# EAGLE design cpu_disc (EAGLE 4.16)
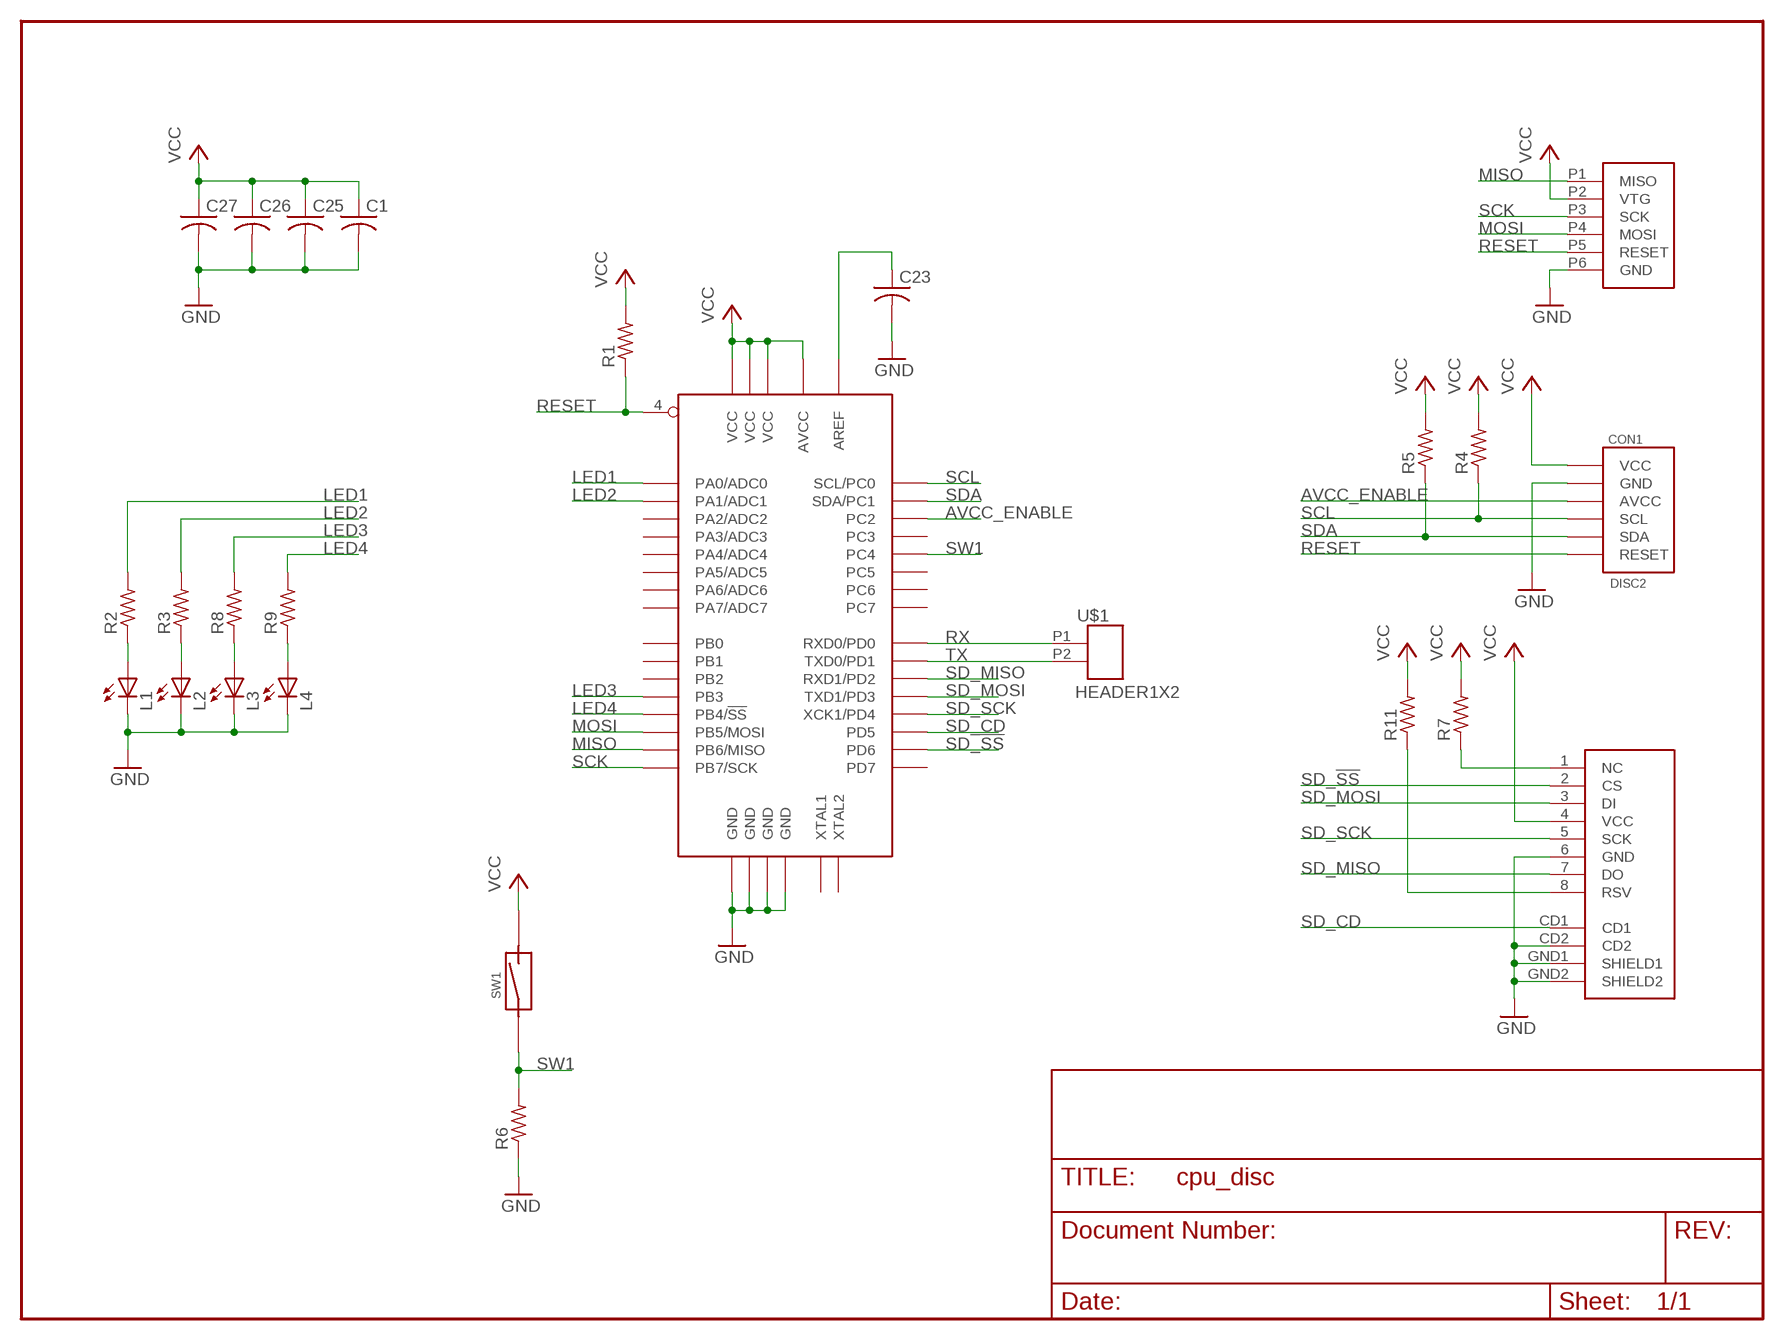
[diagram p0: schematic, sheet 1]

## Parts
C1  C-USC1206  [C1206]
C23  C-USC0603  [C0603]
C25  C-USC0805  [C0805]
C26  C-USC0805  [C0805]
C27  C-USC0805  [C0805]
CON1  DISC2  [DISC2]
IC1  ATMEGA644P  [TQFP44]
ISP1  AVR_ISP_6  [AVR_ISP_6]
L1  LEDCHIP-LED0603  [CHIP-LED0603]
L2  LEDCHIP-LED0603  [CHIP-LED0603]
L3  LEDCHIP-LED0603  [CHIP-LED0603]
L4  LEDCHIP-LED0603  [CHIP-LED0603]
R1  R-US_R0603  [R0603]
R2  R-US_R0603  [R0603]
R3  R-US_R0603  [R0603]
R4  R-US_R0603  [R0603]
R5  R-US_R0603  [R0603]
R6  R-US_R0603  [R0603]
R7  R-US_R0603  [R0603]
R8  R-US_R0603  [R0603]
R9  R-US_R0603  [R0603]
R11  R-US_R0603  [R0603]
SW1  FR2259  [FR2259]
U$1  HEADER1X2  [HEADER1X2]
U$5  USD-SOCKETUSD  [USD-SOCKET-PP]

## Nets
AREF: C23.1 IC1.29(AREF)
AVCC_ENABLE: CON1.AVCC IC1.21(PC2)
GND: C1.2 C23.2 C25.2 C26.2 C27.2 CON1.GND IC1.6(GND) IC1.18(GND) IC1.28(GND) IC1.39(GND) ISP1.P6(GND) L1.C L2.C L3.C L4.C R6.1 U$5.6(GND) U$5.CD2 U$5.GND1(SHIELD1) U$5.GND2(SHIELD2)
LED1: IC1.37(PA0/ADC0) R2.2
LED2: IC1.36(PA1/ADC1) R3.2
LED3: IC1.43(PB3) R8.2
LED4: IC1.44(PB4/!SS) R9.2
MISO: IC1.2(PB6/MISO) ISP1.P1(MISO)
MOSI: IC1.1(PB5/MOSI) ISP1.P4(MOSI)
N$1: L1.A R2.1
N$2: L2.A R3.1
N$4: R7.1 U$5.1(NC)
N$5: R11.1 U$5.8(RSV)
N$6: L3.A R8.1
N$7: L4.A R9.1
RESET: CON1.RESET IC1.4(RESET) ISP1.P5(RESET) R1.1
RX: IC1.9(RXD0/PD0) U$1.P1
SCK: IC1.3(PB7/SCK) ISP1.P3(SCK)
SCL: CON1.SCL IC1.19(SCL/PC0) R4.1
SD_!SS: IC1.15(PD6) U$5.2(CS)
SD_CD: IC1.14(PD5) U$5.CD1
SD_MISO: IC1.11(RXD1/PD2) U$5.7(DO)
SD_MOSI: IC1.12(TXD1/PD3) U$5.3(DI)
SD_SCK: IC1.13(XCK1/PD4) U$5.5(SCK)
SDA: CON1.SDA IC1.20(SDA/PC1) R5.1
SW1: IC1.23(PC4) R6.2 SW1.P$1
TX: IC1.10(TXD0/PD1) U$1.P2
VCC: C1.1 C25.1 C26.1 C27.1 CON1.VCC IC1.5(VCC) IC1.17(VCC) IC1.27(AVCC) IC1.38(VCC) ISP1.P2(VTG) R1.2 R4.2 R5.2 R7.2 R11.2 SW1.P$2 U$5.4(VCC)
Unconnected: IC1.7(XTAL2) IC1.8(XTAL1) IC1.16(PD7) IC1.22(PC3) IC1.24(PC5) IC1.25(PC6) IC1.26(PC7) IC1.30(PA7/ADC7) IC1.31(PA6/ADC6) IC1.32(PA5/ADC5) IC1.33(PA4/ADC4) IC1.34(PA3/ADC3) IC1.35(PA2/ADC2) IC1.40(PB0) IC1.41(PB1) IC1.42(PB2)

## Library data of the parts
C1 C23 C25-C27 = rcl:C-US: CAPACITOR, American symbol
CON1 = anton:DISC2
IC1 = anton:ATMEGA644P
ISP1 = anton:AVR_ISP_6
L1-L4 = led:LED: LED OSRAM: - CHIPLED LG R971, LG N971, LY N971, LG Q971, LY Q971, LO R971, LY R971 LH N974, LH R974 LS Q976, LO Q976, LY Q976 LO Q996 - Hyper CHIPLED LW Q18S LB Q993, LB Q99A, LB R99A - SideLED LS A670, LO A670, LY A670, LG A670, LP A670 LB A673, LV A673, LT A673, LW A673 LH A674 LY A675 LS A676, LA A676, LO A676, LY A676, LW A676 LS A679, LY A679, LG A679 - Hyper Micro SIDELED® LS Y876, LA Y876, LO Y876, LY Y876 LT Y87S - SmartLED LW L88C, LW L88S LB L89C, LB L89S, LG L890 LS L89K, LO L89K, LY L89K LS L896, LA L896, LO L896, LY L896 - TOPLED LS T670, LO T670, LY T670, LG T670, LP T670 LSG T670, LSP T670, LSY T670, LOP T670, LYG T670 LG T671, LOG T671, LSG T671 LB T673, LV T673, LT T673, LW T673 LH T674 LS T676, LA T676, LO T676, LY T676, LB T676, LH T676, LSB T676, LW T676 LB T67C, LV T67C, LT T67C, LS T67K, LO T67K, LY T67K, LW E67C LS E67B, LA E67B, LO E67B, LY E67B, LB E67C, LV E67C, LT E67C LW T67C LS T679, LY T679, LG T679 LS T770, LO T770, LY T770, LG T770, LP T770 LB T773, LV T773, LT T773, LW T773 LH T774 LS E675, LA E675, LY E675, LS T675 LS T776, LA T776, LO T776, LY T776, LB T776 LHGB T686 LT T68C, LB T68C - Hyper Mini TOPLED® LB M676 - Mini TOPLED Santana® LG M470 LS M47K, LO M47K, LY M47K Source: http://www.osram.convergy.de - LUMILED® LXK2-PW12-R00, LXK2-PW12-S00, LXK2-PW14-U00, LXK2-PW14-V00 LXK2-PM12-R00, LXK2-PM12-S00, LXK2-PM14-U00 LXK2-PE12-Q00, LXK2-PE12-R00, LXK2-PE12-S00, LXK2-PE14-T00, LXK2-PE14-U00 LXK2-PB12-K00, LXK2-PB12-L00, LXK2-PB12-M00, LXK2-PB14-N00, LXK2-PB14-P00, LXK2-PB14-Q00 LXK2-PR12-L00, LXK2-PR12-M00, LXK2-PR14-Q00, LXK2-PR14-R00 LXK2-PD12-Q00, LXK2-PD12-R00, LXK2-PD12-S00 LXK2-PH12-R00, LXK2-PH12-S00 LXK2-PL12-P00, LXK2-PL12-Q00, LXK2-PL12-R00 Source: www.luxeon.com
R1-R9 R11 = rcl:R-US_: RESISTOR, American symbol
SW1 = anton:FR2259
U$1 = anton:HEADER1X2
U$5 = SparkFunEagle-6-6-07:USD-SOCKET: microSD Socket Push-push type uSD socket. Schematic element and footprint production proven. Spark Fun Electronics SKU : PRT-00127. tDoc lines correctly indicate media card edge positions when inserting (unlocked, locked, depressed).

## Board
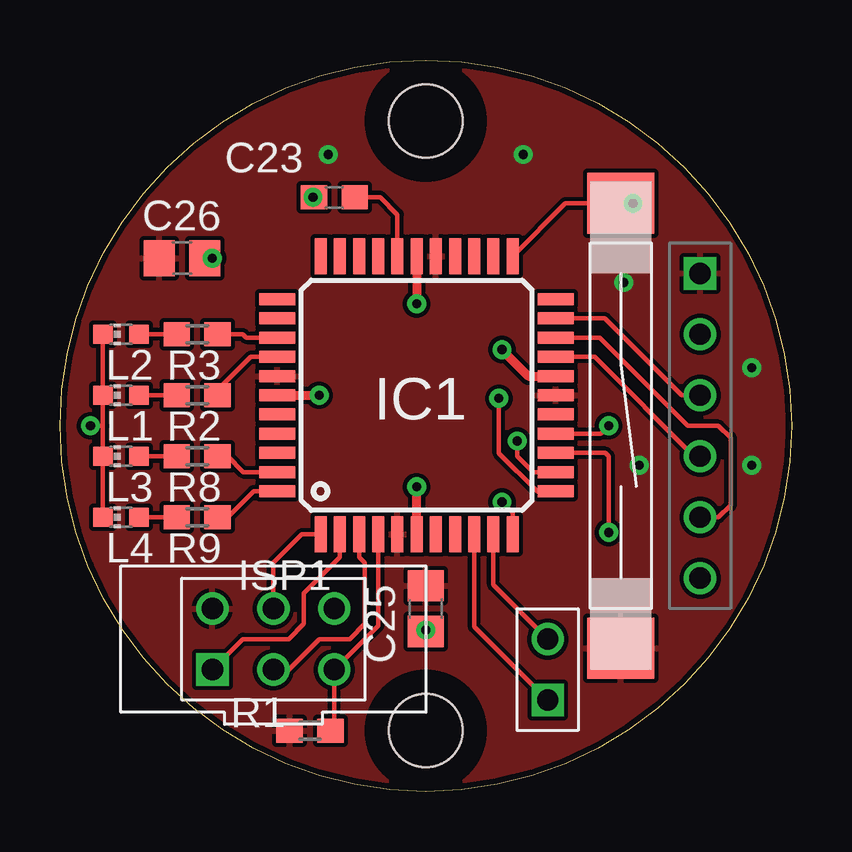
[diagram p1: board, top side]
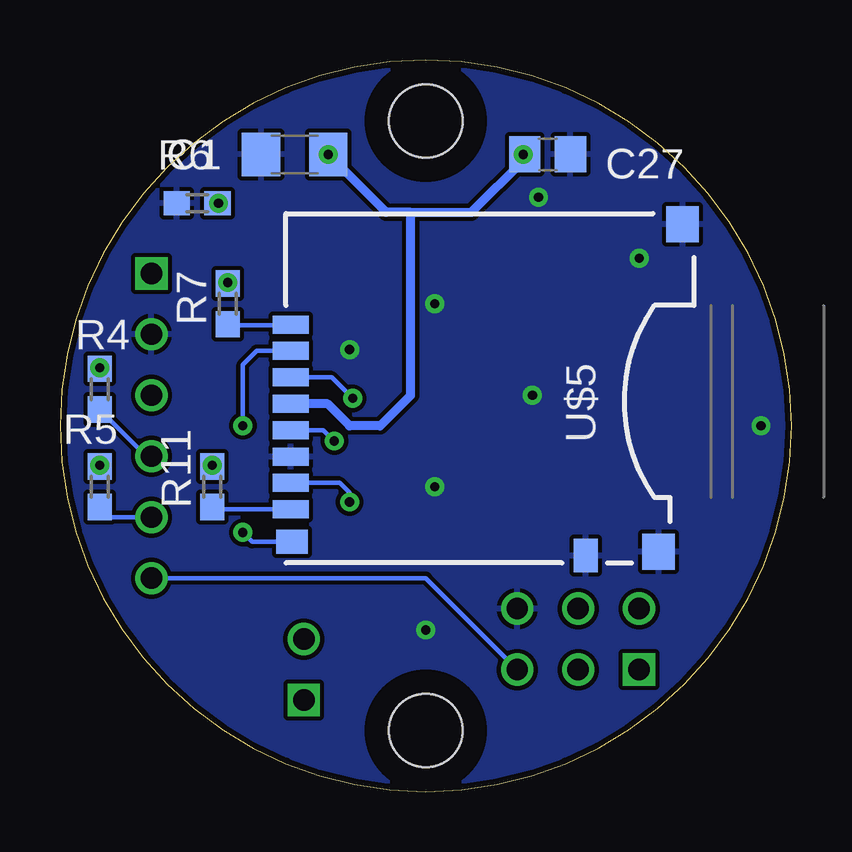
[diagram p2: board, bottom side, seen from below]

Size 30.48 x 30.48 mm. Coordinates in mm from the lower left corner, seen from the top.
Copper layers (1*16): Top 0.035mm / dielectric 1.5mm / Bottom 0.035mm
Design rules "AdvancedCircuts": minimum track width 7mil, minimum drill 15mil, track to track 7mil, track to pad 7mil, pad to pad 7mil, via to via 7mil, smd to smd 0mil, copper to edge 10mil, drill to drill 8mil, minimum pad ring 9mil, minimum via ring 8mil, stop-mask expansion 4mil, vias tented up to drill 0mil, thermal gap 7mil

### Footprints (pad centres in the part's own frame; a part is rotated, then mirrored left to right if it is on the bottom)
C1206 = smd 1.6 x 1.8: 1 -1.4,0; 2 1.4,0
C0603 = smd 1.1 x 1: 1 -0.85,0; 2 0.85,0
C0805 = smd 1.3 x 1.5: 1 -0.95,0; 2 0.95,0
DISC2 = drill 0.889 round: AVCC 11.43,1.27; GND 11.43,3.81; RESET 11.43,-6.35; SCL 11.43,-1.27; SDA 11.43,-3.81 | drill 0.889 square: VCC 11.43,6.35 | hole 3.048: 0,-12.7; 0,12.7
TQFP44 = smd 1.5 x 0.5: 1 -5.8,4; 2 -5.8,3.2; 3 -5.8,2.4; 4 -5.8,1.6; 5 -5.8,0.8; 6 -5.8,0; 7 -5.8,-0.8; 8 -5.8,-1.6; 9 -5.8,-2.4; 10 -5.8,-3.2; 11 -5.8,-4; 23 5.8,-4; 24 5.8,-3.2; 25 5.8,-2.4; 26 5.8,-1.6; 27 5.8,-0.8; 28 5.8,0; 29 5.8,0.8; 30 5.8,1.6; 31 5.8,2.4; 32 5.8,3.2; 33 5.8,4 | smd 0.5 x 1.5: 12 -4,-5.8; 13 -3.2,-5.8; 14 -2.4,-5.8; 15 -1.6,-5.8; 16 -0.8,-5.8; 17 0,-5.8; 18 0.8,-5.8; 19 1.6,-5.8; 20 2.4,-5.8; 21 3.2,-5.8; 22 4,-5.8; 34 4,5.8; 35 3.2,5.8; 36 2.4,5.8; 37 1.6,5.8; 38 0.8,5.8; 39 0,5.8; 40 -0.8,5.8; 41 -1.6,5.8; 42 -2.4,5.8; 43 -3.2,5.8; 44 -4,5.8
AVR_ISP_6 = drill 0.889 square: P1 2.54,1.27 | drill 0.889 round: P2 2.54,-1.27; P3 0,1.27; P4 0,-1.27; P5 -2.54,1.27; P6 -2.54,-1.27
CHIP-LED0603 = smd 0.8 x 0.8: A 0,-0.75; C 0,0.75
R0603 = smd 1.1 x 1: 1 -0.85,0; 2 0.85,0
FR2259 = smd 2.54 x 2.794: P$1 -9.271,0; P$2 9.271,0
HEADER1X2 = drill 0.889 square: P1 0,1.27 | drill 0.889 round: P2 0,-1.27
USD-SOCKET-PP = smd 0.75 x 1.5: 1 3.2,16.8; 2 2.1,16.8; 3 1,16.8; 4 -0.1,16.8; 5 -1.2,16.8; 6 -2.3,16.8; 7 -3.4,16.8; 8 -4.5,16.8 | smd 1 x 1.3: CD1 -5.85,16.75 | smd 1.4 x 1: CD2 -6.425,4.5 | smd 1.5 x 1.35: GND1 -6.275,1.475; GND2 7.375,0.475

### Placement (x,y rotation side)
C1  20.7,26.54 180 bottom
C23  11.43,24.76 180 top
C25  15.24,7.62 270 top
C26  5.08,22.22 0 top
C27  10.16,26.54 0 bottom
CON1  15.24,15.24 0 top
IC1  14.86,16.51 90 top
ISP1  8.89,6.35 180 top
L1  2.54,16.51 90 top
L2  2.54,19.05 90 top
L3  2.54,13.97 90 top
L4  2.54,11.43 90 top
R1  10.41,2.54 180 top
R2  5.72,16.51 0 top
R3  5.72,19.05 0 top
R4  28.83,16.76 90 bottom
R5  28.83,12.7 90 bottom
R6  24.77,24.51 0 bottom
R7  23.5,20.32 90 bottom
R8  5.72,13.97 0 top
R9  5.72,11.43 0 top
R11  24.13,12.7 90 bottom
SW1  23.37,15.24 270 top
U$1  20.32,5.08 180 top
U$5  4.06,16.26 90 bottom

### Tracks (layer width: path | path; a pad name or v marks a point on that pad's centre or on a via)
AREF
  Top 0.178: IC1.29 14.06,24.04 13.34,24.76 C23.1 12.07,24.76
AVCC_ENABLE
  Top 0.178: IC1.21 22.71,19.71 25.91,16.51 CON1.AVCC
GND  (via drill 0.38)
  Top 0.178: L2.C 1.79,16.62 1.91,16.51 L1.C 1.79,15.24 | 1.79,15.24 1.79,14.09 1.91,13.97 L3.C 1.79,11.54 1.91,11.43 L4.C | 1.79,15.24 v1.27,15.24 | C26.2 v6.35,22.22 | C23.2 v10.54,24.76 | C25.2 v15.24,6.73
  Top 0.381: IC1.6 v14.86,12.7 | IC1.39 v10.79,16.51 | IC1.28 v14.86,20.32 | IC1.18 19.52,17.31 v18.41,18.41
  pour Bottom: 15.24,30.48 arc-90 30.48,15.24 arc-90 15.24,0 arc-90 0,15.24 arc-90
LED1
  Top 0.178: R2.2 6.35,16.51 7.95,18.11 IC1.37
LED2
  Top 0.178: IC1.36 7.76,18.91 7.62,19.05 R3.2 6.35,19.05
LED3
  Top 0.178: IC1.43 7.65,13.31 6.99,13.97 R8.2 6.35,13.97
LED4
  Top 0.178: IC1.44 8.07,12.51 6.99,11.43 R9.2
MISO
  Top 0.178: IC1.2 11.66,9.75 10.16,8.25 10.16,6.98 9.53,6.35 7.62,6.35 ISP1.P1
MOSI
  Top 0.178: IC1.1 10.08,10.71 8.89,9.52 ISP1.P4
N$1
  Top 0.178: 5.08,16.51 R2.1 L1.A
N$2
  Top 0.178: 5.08,19.05 R3.1 L2.A
N$4
  Bottom 0.178: R7.1 23.5,19.43 20.89,19.43 U$5.1
N$5
  Bottom 0.178: R11.1 24.13,12.07 23.82,11.76 U$5.8
N$6
  Top 0.178: 5.08,13.97 R8.1 L3.A
N$7
  Top 0.178: 5.08,11.43 R9.1 L4.A
RESET
  Top 0.178: R1.1 11.43,2.54 ISP1.P5 13.26,6.91 IC1.4
  Bottom 0.178: CON1.RESET 15.24,8.89 ISP1.P5
RX
  Top 0.178: IC1.9 17.26,6.87 U$1.P1
SCK
  Top 0.178: ISP1.P3 9.53,5.08 10.79,6.35 12.07,6.35 12.7,6.98 12.7,9.52 12.46,9.77 IC1.3
SCL
  Top 0.178: IC1.19 22.28,18.11 26.42,13.97 CON1.SCL
  Bottom 0.178: R4.1 26.89,13.97 CON1.SCL
SD_!SS  (via drill 0.38)
  Top 0.178: IC1.15 22.53,14.91 v22.86,15.24
  Bottom 0.178: U$5.2 22.28,18.36 22.86,17.78 v22.86,15.24
SD_CD  (via drill 0.38)
  Top 0.178: IC1.14 22.72,14.11 22.86,13.97 v22.86,10.79
  Bottom 0.178: U$5.CD1 22.47,10.41 v22.86,10.79
SD_MISO  (via drill 0.38)
  Top 0.178: IC1.11 18.86,11.62 v18.41,12.07
  Bottom 0.178: v18.41,12.07 18.41,12.45 18.83,12.86 U$5.7
SD_MOSI  (via drill 0.38)
  Top 0.178: IC1.12 19.88,12.51 18.29,14.1 v18.29,16.38
  Bottom 0.178: U$5.3 19.16,17.26 v18.29,16.38
SD_SCK  (via drill 0.38)
  Top 0.178: IC1.13 19.71,13.31 19.05,13.97 v19.05,14.61
  Bottom 0.178: U$5.5 19.5,15.06 v19.05,14.61
SDA
  Top 0.178: IC1.20 22.49,18.91 26.16,15.24 27.43,15.24 27.94,14.73 27.94,11.94 27.43,11.43 CON1.SDA
  Bottom 0.178: R5.1 28.83,11.43 CON1.SDA
SW1  (via drill 0.38)
  Top 0.178: v23.88,24.51 SW1.P$1 21.06,24.51 IC1.23
  Bottom 0.178: v23.88,24.51 R6.2
TX
  Top 0.178: IC1.10 18.06,8.61 U$1.P2
VCC  (via drill 0.38)
  Bottom 0.178: R5.2 v28.83,13.59 | R4.2 v28.83,17.65 | R11.2 v24.13,13.59 | R7.2 v23.5,21.21
  Bottom 0.381: U$5.4 19.33,16.16 18.41,15.24 17.15,15.24 15.88,16.51 15.88,24.13 | 15.88,24.13 16.89,24.13 C1.1 19.18,26.54 | 19.18,26.54 C1.1 | 19.18,26.54 19.05,26.67 | 15.88,24.13 13.34,24.13 11.11,26.36 C27.1
  other vias: 11.18,26.54 19.3,26.54
  pour Top: 15.24,30.48 arc-90 30.48,15.24 arc-90 15.24,0 arc-90 0,15.24 arc-90